# Altium schematic sheet Control_Sense_TOP_VAC.SchDoc (part 2 of 4)
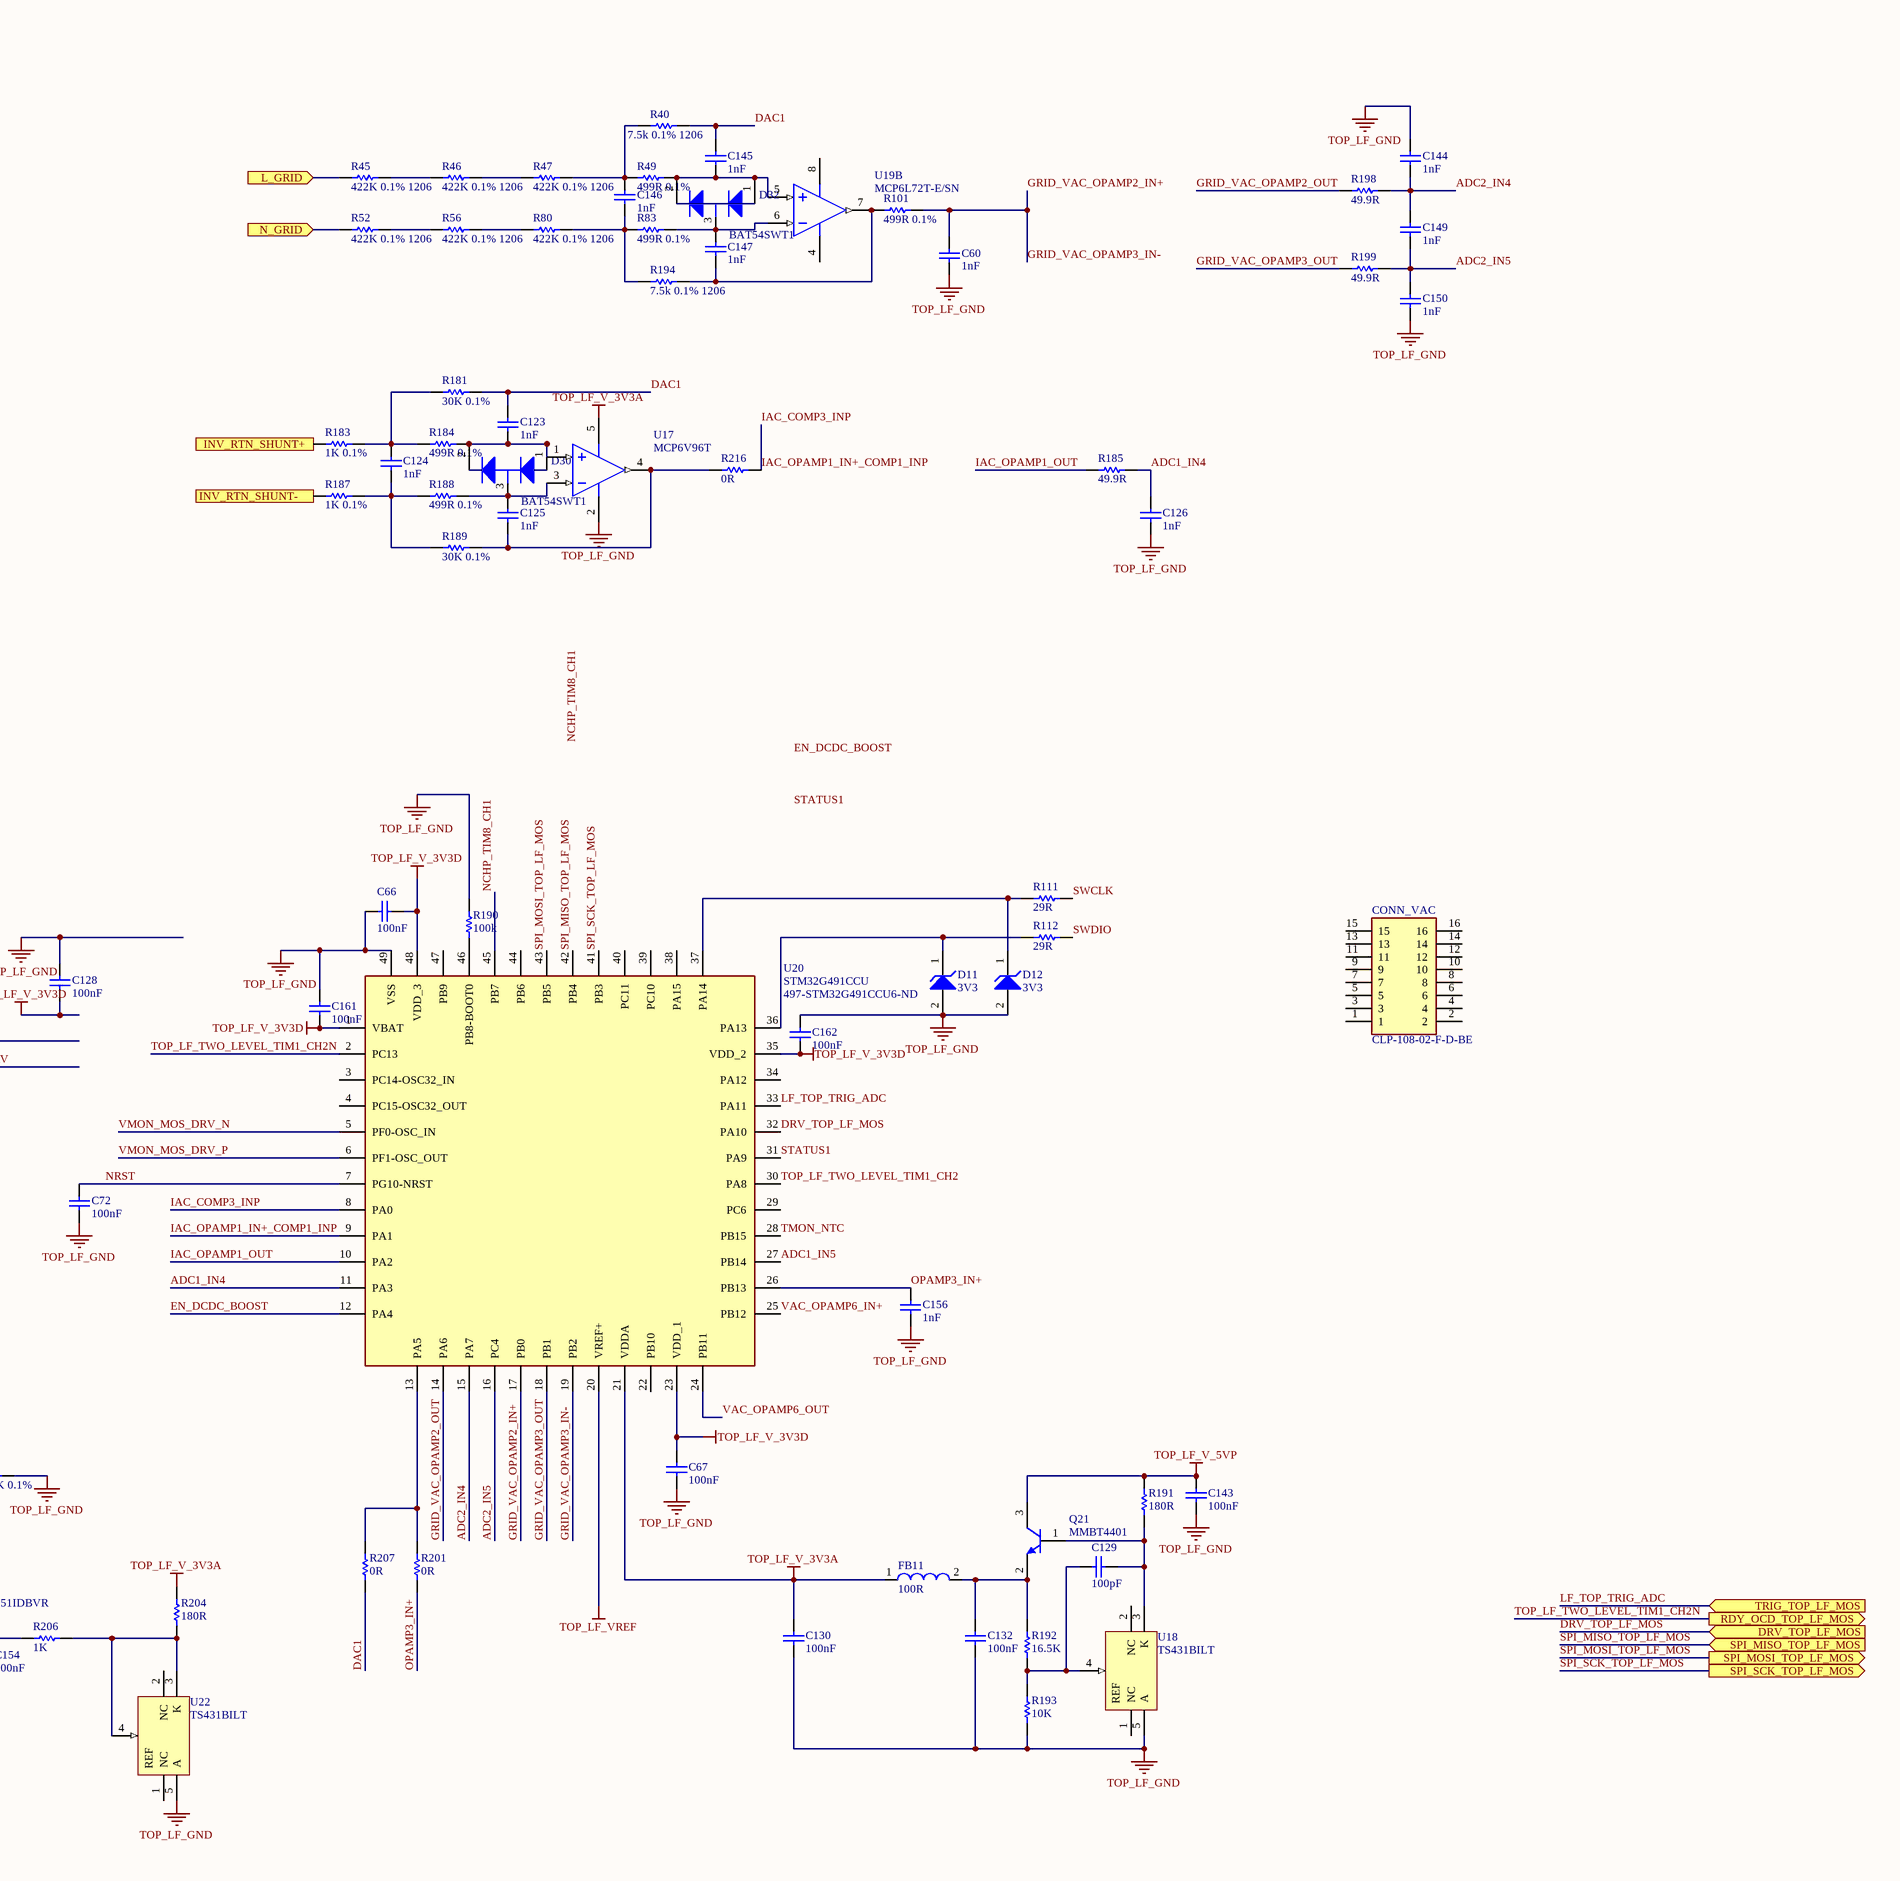
[diagram p4: Control_Sense_TOP_VAC.SchDoc, bottom right]
## Library data of the parts
C30 C41 C66 C67 C106 C108 C109 C128 C130 C132 C143 C152 C154 C155 C161 C162 = CMP-2000-05332-1: Cap Ceramic 0.1uF 50VDC X7R 10% SMD 0603 Paper T/R; Manufacturer: Samsung Electro-Mechanics; Manufacturer Part Number: CL10B104KB8NNNC; Capacitance: 0.1µF; Rated Voltage: 50V; Case Size/Dimension: 0603; Datasheet URL: https://datasheet.ciiva.com/29198/456651-da-01-en-vs-kondensator-0605-29198839.pdf; Manufacturer URL: http://www.samsungsem.com/global/index.jsp; Dielectric: X7R; Tolerance (%): ±10%; Datasheet Version: Nov-10; Supplier 1: Digi-Key; Supplier Part Number 1: 1276-1000-1-ND; RoHS: Yes; Category: Ceramic Capacitors; Stock 1: 13409690; Pricing 1: 1=0.10000, 10=0.03000, 50=0.01620, 100=0.01330, 500=0.00950, 1000=0.00746 (USD); Mount: Surface Mount; Case/Package: 0603; Case Code (Metric): 1608; Case Code (Imperial): 0603; Contact Plating: Tin; Material: Ceramic; Min Operating Temperature: -55°C; Max Operating Temperature: 125°C; Voltage Rating: 50V; Package Quantity: 1; Packaging: Tape and Reel; Tolerance: 10%; Voltage Rating (DC): 50V; Voltage: 50V; Series: CL; Construction: Flat; Length: 1.6mm; Width: 0.031inch; Height: 0.8mm; Depth: 0.8mm; Thickness: 0.035inch; Radiation Hardening: No; Lead Free: Lead Free; RoHS Compliant: Yes; ComponentLink1URL: https://datasheet.ciiva.com/25803/cl10b104kb8nnnc-25803393.pdf?src-supplier=Digi-Key; ComponentLink1Description: https://datasheet.ciiva.com/25803/cl10b104kb8nnnc-25803393.pdf?src-supplier=Digi-Key; ComponentLink2URL: https://datasheet.ciiva.com/26838/getdatasheetpartid-89097-26838411.pdf?src-supplier=Verical; ComponentLink2Description: https://datasheet.ciiva.com/26838/getdatasheetpartid-89097-26838411.pdf?src-supplier=Verical; ComponentLink3URL: https://datasheet.ciiva.com/29198/456651-da-01-en-vs-kondensator-0605-29198839.pdf?src-supplier=Conrad; ComponentLink3Description: https://datasheet.ciiva.com/29198/456651-da-01-en-vs-kondensator-0605-29198839.pdf?src-supplier=Conrad
C50-C52 C60 C93-C95 C99 C103-C105 C123-C125 C141 C145-C147 C158 = CMP-2006-04245-1: Manufacturer: AVX Interconnect / Elco; Part Number: 06035A151JAT2A.; Manufacturer Part Number: 06035A151JAT2A; Dielectric Material: Ceramic; Capacitance: 100pF; Tolerance: 5%; Voltage Rating (DC): 50V; Dielectric: C0G; Temperature Coefficient: 30ppm/°C; Insulation Resistance: 100GR; Supplier 1: Digi-Key; Supplier Part Number 1: 478-1177-1-ND; RoHS: Yes; Category: Ceramic Capacitors; Stock 1: 63714; Pricing 1: 1=0.12000, 10=0.08900, 100=0.04180, 500=0.02932, 1000=0.02428 (USD); Mount: Surface Mount,PCB; Case/Package: 0603; Number of Pins: 2; Case Code (Metric): 1608; Case Code (Imperial): 0603; Contact Plating: Tin,Matte; Min Operating Temperature: -55°C; Max Operating Temperature: 125°C; Voltage Rating: 50V; Packaging: Tape and Reel; Package Quantity: 1; Termination: SMD/SMT; Voltage: 50V; Length: 1.6mm; Height: 0.86mm; Width: 0.032inch; Depth: 0.81mm; Thickness: 0.035inch; Radiation Hardening: No; Lead Free: Lead Free; REACH SVHC: No SVHC; ComponentLink1URL: https://datasheet.ciiva.com/1124/84496-1124721.pdf?src-supplier=Element14; ComponentLink1Description: https://datasheet.ciiva.com/1124/84496-1124721.pdf?src-supplier=Element14; ComponentLink2URL: https://datasheet.ciiva.com/2987/ccog-2987781.pdf?src-supplier=Avnet; ComponentLink2Description: https://datasheet.ciiva.com/2987/ccog-2987781.pdf?src-supplier=Avnet; ComponentLink3URL: https://datasheet.ciiva.com/7855/759117-7855061.pdf?src-supplier=Element14; ComponentLink3Description: https://datasheet.ciiva.com/7855/759117-7855061.pdf?src-supplier=Element14; ComponentLink4URL: https://datasheet.ciiva.com/2987/ccog-2987782.pdf?src-supplier=Avnet; ComponentLink4Description: https://datasheet.ciiva.com/2987/ccog-2987782.pdf?src-supplier=Avnet; ComponentLink5URL: https://datasheet.ciiva.com/156/ccog-156216.pdf?src-supplier=Digi-Key; ComponentLink5Description: https://datasheet.ciiva.com/156/ccog-156216.pdf?src-supplier=Digi-Key; ComponentLink6URL: https://datasheet.ciiva.com/156/ccog-156217.pdf?src-supplier=Digi-Key; ComponentLink6Description: https://datasheet.ciiva.com/156/ccog-156217.pdf?src-supplier=Digi-Key; ComponentLink7URL: https://datasheet.ciiva.com/156/ccog-156218.pdf?src-supplier=Digi-Key; ComponentLink7Description: https://datasheet.ciiva.com/156/ccog-156218.pdf?src-supplier=Digi-Key; ComponentLink8URL: https://datasheet.ciiva.com/16300/ccog-16300429.pdf?src-supplier=Future+Electronics; ComponentLink8Description: https://datasheet.ciiva.com/16300/ccog-16300429.pdf?src-supplier=Future+Electronics; ComponentLink9URL: https://datasheet.ciiva.com/22699/84496-22699966.pdf?src-supplier=Element14; ComponentLink9Description: https://datasheet.ciiva.com/22699/84496-22699966.pdf?src-supplier=Element14; ComponentLink10URL: https://datasheet.ciiva.com/5418/ccog-5418335.pdf?src-supplier=Mouser; ComponentLink10Description: https://datasheet.ciiva.com/5418/ccog-5418335.pdf?src-supplier=Mouser; ComponentLink11URL: https://datasheet.ciiva.com/16538/ccog-16538111.pdf?src-supplier=Avnet+Asia; ComponentLink11Description: https://datasheet.ciiva.com/16538/ccog-16538111.pdf?src-supplier=Avnet+Asia
C65 C72 C163 = CMP-2008-02743-1: Manufacturer: AVX Interconnect / Elco; Part Number: 04026D104KAT2A; Dielectric Material: Ceramic; Tolerance: 10%; Voltage Rating: 6.3V; Dielectric: X5R; Supplier 1: Newark; Supplier Part Number 1: 34M9214; Manufacturer Part Number: 04026D104KAT2A; RoHS: Yes; Category: Ceramic Capacitors; Stock 1: 1436; Pricing 1: 10=0.02800, 25=0.02300, 50=0.01800, 100=0.01200, 250=0.01100, 500=0.00900, 1000=0.00700 (USD); Mount: Surface Mount; Case/Package: 0402; Case Code (Metric): 1005; Case Code (Imperial): 0402; Contact Plating: Tin,Matte; Min Operating Temperature: -55°C; Max Operating Temperature: 85°C; Package Quantity: 1; Packaging: Tape and Reel; Capacitance: 100nF; Voltage Rating (DC): 6.3V; Voltage: 6.3V; Termination: SMD/SMT; Series: -; Construction: Flat; Length: 1mm; Width: 0.02inch; Height: 0.56mm; Thickness: 0.022inch; Depth: 0.5mm; Radiation Hardening: No; REACH SVHC: No SVHC; Lead Free: Lead Free; RoHS Compliant: Yes
C96 C160 = CMP-2007-03234-1: SMD Multilayer Ceramic Capacitor, 1 µF, 25 V, 0805 [2012 Metric], ± 10%, X7R; Part Number: C0805C105K3RACTU; Manufacturer: Kemet; Voltage Rating: 25V; Supplier 1: Digi-Key; Supplier Part Number 1: 399-8004-1-ND; Manufacturer Part Number: C0805C105K3RACTU; RoHS: Yes; Category: Ceramic Capacitors; Stock 1: 73815; Pricing 1: 1=0.14000, 10=0.09900, 50=0.05620, 100=0.04650, 500=0.03262, 1000=0.02700 (USD); Mount: Surface Mount; Case/Package: 0805; Number of Pins: 2; Case Code (Imperial): 0805; Case Code (Metric): 2012; Dielectric Material: Ceramic; Contact Plating: Tin,Matte; Min Operating Temperature: -55°C; Max Operating Temperature: 125°C; Capacitance: 1uF; Tolerance: 10%; Packaging: Tape and Reel; Dielectric: X7R; Package Quantity: 1; Voltage Rating (DC): 25V; Termination: SMD/SMT; Series: C; Construction: Flat; Voltage: 25V; Length: 2mm; Width: 0.049inch; Height: 1.25mm; Depth: 1.25mm; Thickness: 0.055inch; Radiation Hardening: No; RoHS Compliant: Yes; REACH SVHC: No SVHC; ComponentLink1URL: https://datasheet.ciiva.com/6074/kem-c1002-x7r-smd-6074661.pdf?src-supplier=Farnell; ComponentLink1Description: https://datasheet.ciiva.com/6074/kem-c1002-x7r-smd-6074661.pdf?src-supplier=Farnell; ComponentLink2URL: https://datasheet.ciiva.com/28610/1918693-28610874.pdf?src-supplier=Element14; ComponentLink2Description: https://datasheet.ciiva.com/28610/1918693-28610874.pdf?src-supplier=Element14; ComponentLink3URL: https://datasheet.ciiva.com/46443/1851736-46443533.pdf?src-supplier=Element14; ComponentLink3Description: https://datasheet.ciiva.com/46443/1851736-46443533.pdf?src-supplier=Element14
C97 = CMP-2000-06039-1: Chip Capacitor, 4.7 uF, +/- 10%, 25 V, -55 to 125 degC, 0805 (2012 Metric), RoHS, Tape and Reel; Manufacturer: TDK; PCN Part Number: MLCCPartNumberChange30/Nov/2012; Other Names: 445-5972-2C2012X7R1E475KC2012X7R1E475KT000N; Temperature Coefficient: X7R; Voltage - Rated: 25V; Product Training Modules: CSeriesGeneralApplicationsSEAT,CCV,andTVCLDesignToolsGuidetoReplacinganElectrolyticCapacitorwithanMLCC; Catalog Drawings: CSERIES_2012-0805_1.45; Online Catalog: CSeries,GeneralPurpose; Capacitance: 4.7µF; Package Description: 2-Pin Surface Mount Device, Body 2 x 1.25 mm; Manufacturer URL: http://www.tdk.com/; Features: -; Family: CeramicCapacitors; Applications: GeneralPurpose; Standard Package: 2,000; RoHS Information: RoHSCertificate-MLCC; Operating Temperature: -55°C~125°C; Lead Spacing: -; Lead Style: -; Datasheet Version: 01/2016; Datasheet URL: https://product.tdk.com/info/en/documents/chara_sheet/C2012X7R1E475K125AB.pdf; Series: C; Package Reference: 0805; Category: Capacitors; Ratings: -; Packaging: Tape&Reel(TR); Tolerance: ±10%; Height - Seated (Max): -; Size / Dimension: 0.079"Lx0.049"W(2.00mmx1.25mm); Package / Case: 0805(2012Metric); Mounting Technology: SurfaceMount; Mounting Type: SurfaceMount,MLCC; Thickness (Max): 0.057"(1.45mm)
C102 = CMP-2000-05863-1: Chip Capacitor, 10 uF, +/- 10%, 25 V, -55 to 85 degC, 1206 (3216 Metric), RoHS, Tape and Reel; Manufacturer: AVX; Dielectric: X5R; Capacitance: 10µF; Mounting Technology: SurfaceMount; Package Reference: 1206; Tolerance (%): ±10%; Manufacturer URL: http://www.avx.com/; Rated Voltage: 25V; Datasheet URL: http://datasheets.avx.com/cx5r.pdf; Package Description: 2-Pin Surface Mount Device, Body 3.2 x 1.6 mm; Datasheet Version: 05/2016; Case Size/Dimension: 1206
C107 C129 = CMP-2006-02595-1: 0603 100pF 50V ±5 % Tolerance C0G SMT Multilayer Ceramic Capacitor; Part Number: GRM1885C1H101JA01D; Manufacturer: Murata; Tolerance: 5%; Temperature Coefficient: 30ppm/°C; Insulation Resistance: 10GR; Supplier 1: Digi-Key; Supplier Part Number 1: 490-1427-1-ND; Manufacturer Part Number: GRM1885C1H101JA01D; RoHS: Yes; Category: Ceramic Capacitors; Stock 1: 416176; Pricing 1: 1=0.10000, 10=0.06100, 50=0.03320, 100=0.02700, 500=0.01932, 1000=0.01518 (USD); Mount: Surface Mount; Case/Package: 0603; Number of Pins: 2; Case Code (Metric): 1608; Case Code (Imperial): 0603; Dielectric Material: Ceramic; Material: Ceramic; Weight: 7.1E-05oz; Min Operating Temperature: -55°C; Max Operating Temperature: 125°C; Capacitance: 100pF; Voltage Rating: 50V; Packaging: Tape and Reel; Package Quantity: 1; Voltage Rating (DC): 50V; Dielectric: C0G; Termination: SMD/SMT; Voltage: 50V; Length: 1.6mm; Width: 0.031inch; Height: 0.8mm; Thickness: 0.035inch; Depth: 0.8mm; Radiation Hardening: No; REACH SVHC: Unknown; RoHS Compliant: Yes; Lead Free: Lead Free; ComponentLink1URL: https://datasheet.ciiva.com/131/product-131088.pdf?src-supplier=Digi-Key; ComponentLink1Description: https://datasheet.ciiva.com/131/product-131088.pdf?src-supplier=Digi-Key; ComponentLink2URL: https://datasheet.ciiva.com/18100/getdatasheetpartid-26823-18100641.pdf?src-supplier=Verical; ComponentLink2Description: https://datasheet.ciiva.com/18100/getdatasheetpartid-26823-18100641.pdf?src-supplier=Verical; ComponentLink3URL: https://datasheet.ciiva.com/3777/grm1885c1h101ja0123-3777264.pdf?src-supplier=Arrow+Electronics; ComponentLink3Description: https://datasheet.ciiva.com/3777/grm1885c1h101ja0123-3777264.pdf?src-supplier=Arrow+Electronics; ComponentLink4URL: https://datasheet.ciiva.com/29149/450134-da-01-en-vs-kondensator-0603-29149008.pdf?src-supplier=Conrad; ComponentLink4Description: https://datasheet.ciiva.com/29149/450134-da-01-en-vs-kondensator-0603-29149008.pdf?src-supplier=Conrad; ComponentLink5URL: https://datasheet.ciiva.com/131/partnumbering-e-01-131089.pdf?src-supplier=Digi-Key; ComponentLink5Description: https://datasheet.ciiva.com/131/partnumbering-e-01-131089.pdf?src-supplier=Digi-Key; ComponentLink6URL: https://datasheet.ciiva.com/11605/c02e-11605557.pdf?src-supplier=Avnet; ComponentLink6Description: https://datasheet.ciiva.com/11605/c02e-11605557.pdf?src-supplier=Avnet; ComponentLink7URL: https://datasheet.ciiva.com/28556/4360-28556551.pdf?src-supplier=Element14; ComponentLink7Description: https://datasheet.ciiva.com/28556/4360-28556551.pdf?src-supplier=Element14; ComponentLink8URL: https://datasheet.ciiva.com/7828/4360-7828889.pdf?src-supplier=Element14; ComponentLink8Description: https://datasheet.ciiva.com/7828/4360-7828889.pdf?src-supplier=Element14; ComponentLink9URL: https://datasheet.ciiva.com/7828/4360-7828890.pdf?src-supplier=Element14; ComponentLink9Description: https://datasheet.ciiva.com/7828/4360-7828890.pdf?src-supplier=Element14; ComponentLink10URL: https://datasheet.ciiva.com/7828/4360-7828891.pdf?src-supplier=Element14; ComponentLink10Description: https://datasheet.ciiva.com/7828/4360-7828891.pdf?src-supplier=Element14; ComponentLink11URL: https://datasheet.ciiva.com/14116/grmseries-tc-hitype-eng-14116828.pdf?src-supplier=Distrelec; ComponentLink11Description: https://datasheet.ciiva.com/14116/grmseries-tc-hitype-eng-14116828.pdf?src-supplier=Distrelec; ComponentLink12URL: https://datasheet.ciiva.com/16291/product-16291613.pdf?src-supplier=Future+Electronics; ComponentLink12Description: https://datasheet.ciiva.com/16291/product-16291613.pdf?src-supplier=Future+Electronics; ComponentLink13URL: https://datasheet.ciiva.com/131/partnumbering-e-01-131087.pdf?src-supplier=Digi-Key; ComponentLink13Description: https://datasheet.ciiva.com/131/partnumbering-e-01-131087.pdf?src-supplier=Digi-Key; ComponentLink14URL: https://datasheet.ciiva.com/14116/grmseries-tc-hitype-eng-14116815.pdf?src-supplier=Distrelec; ComponentLink14Description: https://datasheet.ciiva.com/14116/grmseries-tc-hitype-eng-14116815.pdf?src-supplier=Distrelec
C110 = CMP-2006-04481-1: Cap Ceramic 4.7uF 6.3VDC X5R 10% SMD 0603 Paper T/R; Part Number: 06036D475KAT2A; Manufacturer: AVX Interconnect / Elco; Tolerance: 20%; Voltage Rating (DC): 6.3V; Supplier 1: Mouser; Supplier Part Number 1: 581-06036D475K; Manufacturer Part Number: 06036D475KAT2A; RoHS: Yes; Category: Ceramic Capacitors; Stock 1: 80199; Pricing 1: 1=0.19000, 10=0.11100, 50=0.11100, 100=0.06000, 1000=0.04900, 10000=0.04800 (USD); Mount: Surface Mount,PCB; Case/Package: 0603; Number of Pins: 2; Case Code (Metric): 1608; Case Code (Imperial): 0603; Contact Plating: Tin,Matte; Dielectric Material: Ceramic; Min Operating Temperature: -55°C; Max Operating Temperature: 85°C; Capacitance: 4.7uF; Packaging: Tape and Reel; Voltage Rating: 6.3V; Package Quantity: 1; Dielectric: X5R; Voltage: 6.3V; Termination: SMD/SMT; Series: -; Construction: Flat; Length: 1.6mm; Width: 0.032inch; Height: 0.9mm; Thickness: 0.035inch; Depth: 0.81mm; Radiation Hardening: No; REACH SVHC: No SVHC; Lead Free: Lead Free; RoHS Compliant: Yes; ComponentLink1URL: https://datasheet.ciiva.com/1458/1796776-1458120.pdf?src-supplier=Element14; ComponentLink1Description: https://datasheet.ciiva.com/1458/1796776-1458120.pdf?src-supplier=Element14; ComponentLink2URL: https://datasheet.ciiva.com/15212/getdatasheetpartid-149720-15212362.pdf?src-supplier=Verical; ComponentLink2Description: https://datasheet.ciiva.com/15212/getdatasheetpartid-149720-15212362.pdf?src-supplier=Verical; ComponentLink3URL: https://datasheet.ciiva.com/151/cx5r-151515.pdf?src-supplier=Digi-Key; ComponentLink3Description: https://datasheet.ciiva.com/151/cx5r-151515.pdf?src-supplier=Digi-Key; ComponentLink4URL: https://datasheet.ciiva.com/151/cx5r-151516.pdf?src-supplier=Digi-Key; ComponentLink4Description: https://datasheet.ciiva.com/151/cx5r-151516.pdf?src-supplier=Digi-Key; ComponentLink5URL: https://datasheet.ciiva.com/22677/lt-22677180.pdf?src-supplier=Element14; ComponentLink5Description: https://datasheet.ciiva.com/22677/lt-22677180.pdf?src-supplier=Element14; ComponentLink6URL: https://datasheet.ciiva.com/22700/1796776-22700572.pdf?src-supplier=Element14; ComponentLink6Description: https://datasheet.ciiva.com/22700/1796776-22700572.pdf?src-supplier=Element14; ComponentLink7URL: https://datasheet.ciiva.com/151/cx5r-151517.pdf?src-supplier=Digi-Key; ComponentLink7Description: https://datasheet.ciiva.com/151/cx5r-151517.pdf?src-supplier=Digi-Key; ComponentLink8URL: https://datasheet.ciiva.com/2987/cx5r-2987869.pdf?src-supplier=Avnet; ComponentLink8Description: https://datasheet.ciiva.com/2987/cx5r-2987869.pdf?src-supplier=Avnet; ComponentLink9URL: https://datasheet.ciiva.com/6150/lt-6150797.pdf?src-supplier=Farnell; ComponentLink9Description: https://datasheet.ciiva.com/6150/lt-6150797.pdf?src-supplier=Farnell; ComponentLink10URL: https://datasheet.ciiva.com/7855/1666675-7855102.pdf?src-supplier=Element14; ComponentLink10Description: https://datasheet.ciiva.com/7855/1666675-7855102.pdf?src-supplier=Element14
C111 = CMP-2000-05332-1: Cap Ceramic 4.7uF 6.3VDC X5R 10% SMD 0603 Paper T/R; Manufacturer: Samsung Electro-Mechanics; Manufacturer Part Number: CL10B104KB8NNNC; Capacitance: 0.1µF; Rated Voltage: 50V; Dielectric: X7R; Case Size/Dimension: 0603; Datasheet URL: https://datasheet.ciiva.com/29198/456651-da-01-en-vs-kondensator-0605-29198839.pdf; Manufacturer URL: http://www.samsungsem.com/global/index.jsp; Tolerance (%): ±10%; Datasheet Version: Nov-10; Supplier 1: Digi-Key; Supplier Part Number 1: 1276-1000-1-ND; RoHS: Yes; Category: Ceramic Capacitors; Stock 1: 13409690; Pricing 1: 1=0.10000, 10=0.03000, 50=0.01620, 100=0.01330, 500=0.00950, 1000=0.00746 (USD); Mount: Surface Mount; Case/Package: 0603; Case Code (Metric): 1608; Case Code (Imperial): 0603; Contact Plating: Tin; Material: Ceramic; Min Operating Temperature: -55°C; Max Operating Temperature: 125°C; Voltage Rating: 50V; Package Quantity: 1; Packaging: Tape and Reel; Tolerance: 10%; Voltage Rating (DC): 50V; Voltage: 50V; Series: CL; Construction: Flat; Length: 1.6mm; Width: 0.031inch; Height: 0.8mm; Depth: 0.8mm; Thickness: 0.035inch; Radiation Hardening: No; Lead Free: Lead Free; RoHS Compliant: Yes; ComponentLink1URL: https://datasheet.ciiva.com/25803/cl10b104kb8nnnc-25803393.pdf?src-supplier=Digi-Key; ComponentLink1Description: https://datasheet.ciiva.com/25803/cl10b104kb8nnnc-25803393.pdf?src-supplier=Digi-Key; ComponentLink2URL: https://datasheet.ciiva.com/26838/getdatasheetpartid-89097-26838411.pdf?src-supplier=Verical; ComponentLink2Description: https://datasheet.ciiva.com/26838/getdatasheetpartid-89097-26838411.pdf?src-supplier=Verical; ComponentLink3URL: https://datasheet.ciiva.com/29198/456651-da-01-en-vs-kondensator-0605-29198839.pdf?src-supplier=Conrad; ComponentLink3Description: https://datasheet.ciiva.com/29198/456651-da-01-en-vs-kondensator-0605-29198839.pdf?src-supplier=Conrad
C112 = CMP-2100-03644-1: Chip Capacitor, 0.1 uF, +/- 10%, 50 V, -55 to 125 degC, 0805 (2012 Metric), RoHS, Tape and Reel; Manufacturer: Murata; Manufacturer Part Number: GRM21BR71H104KA01L; Voltage: 50V; Capacitance: 100nF; Insulation Resistance: 10GR; Dielectric Material: Ceramic; Dielectric: X7R; Package Description: 2-Pin Surface Mount Device, Body 2 x 1.25 mm; Manufacturer URL: http://www.murata.com/; Case Code (Imperial): 0805; Datasheet URL: http://psearch.en.murata.com/capacitor/product/GRM21BR71H104KA01%23.pdf; Termination: SMD/SMT; Lead Free: LeadFree; Package Quantity: 1; Mount: SurfaceMount; REACH SVHC: Unknown; Thickness: 0.053inch; Height: 1.25mm; Case/Package: 0805; Voltage Rating: 50V; Width: 0.049inch; Case Code (Metric): 2012; Material: Ceramic; Min Operating Temperature: -55degC; RoHSCompliant: true; Datasheet Version: 42675.0; Voltage Rating (DC): 50V; Tolerance: 10%; Package Reference: 0805; Depth: 1.25mm; Length: 2mm; Max Operating Temperature: 125degC; Packaging: TapeandReel; Number of Pins: 2; Radiation Hardening: No; Supplier 1: Farnell; Supplier Part Number 1: 2408531; RoHS: Yes; Category: Ceramic Capacitors; Stock 1: 576000; ComponentLink1URL: https://datasheet.ciiva.com/11786/0900766b8003061f-11786305.pdf?src-supplier=RSComponents; ComponentLink1Description: https://datasheet.ciiva.com/11786/0900766b8003061f-11786305.pdf?src-supplier=RSComponents; ComponentLink2URL: https://datasheet.ciiva.com/20173/71-2024-20173169.pdf?src-supplier=Rapid+Electronics; ComponentLink2Description: https://datasheet.ciiva.com/20173/71-2024-20173169.pdf?src-supplier=Rapid+Electronics; ComponentLink3URL: https://datasheet.ciiva.com/29200/453120-da-01-en-vs-kondensator-0805-29200537.pdf?src-supplier=Conrad; ComponentLink3Description: https://datasheet.ciiva.com/29200/453120-da-01-en-vs-kondensator-0805-29200537.pdf?src-supplier=Conrad; ComponentLink4URL: https://datasheet.ciiva.com/132/partnumbering-e-01-132209.pdf?src-supplier=Digi-Key; ComponentLink4Description: https://datasheet.ciiva.com/132/partnumbering-e-01-132209.pdf?src-supplier=Digi-Key; ComponentLink5URL: https://datasheet.ciiva.com/132/partnumbering-e-01-132210.pdf?src-supplier=Digi-Key; ComponentLink5Description: https://datasheet.ciiva.com/132/partnumbering-e-01-132210.pdf?src-supplier=Digi-Key; ComponentLink6URL: https://datasheet.ciiva.com/132/partnumbering-e-01-132211.pdf?src-supplier=Digi-Key; ComponentLink6Description: https://datasheet.ciiva.com/132/partnumbering-e-01-132211.pdf?src-supplier=Digi-Key; ComponentLink7URL: https://datasheet.ciiva.com/7937/1794405-7937708.pdf?src-supplier=Element14; ComponentLink7Description: https://datasheet.ciiva.com/7937/1794405-7937708.pdf?src-supplier=Element14; ComponentLink8URL: https://datasheet.ciiva.com/7937/1794405-7937709.pdf?src-supplier=Element14; ComponentLink8Description: https://datasheet.ciiva.com/7937/1794405-7937709.pdf?src-supplier=Element14; ComponentLink9URL: https://datasheet.ciiva.com/28534/1769893-28534317.pdf?src-supplier=Element14; ComponentLink9Description: https://datasheet.ciiva.com/28534/1769893-28534317.pdf?src-supplier=Element14; ComponentLink10URL: https://datasheet.ciiva.com/7937/4360-7937710.pdf?src-supplier=Element14; ComponentLink10Description: https://datasheet.ciiva.com/7937/4360-7937710.pdf?src-supplier=Element14
C113 = CAPC_1u_0805_X7R_16V_10%: Capacitor SMD Cer 1uF 10% 16V X7R 0805; Manufacturer 1: Yageo; Manufacturer Part Number 1: CC0805KKX7R7BB105; Ratings: 16V; X7R; Material: ceramic; SCDType: spec; Package / Case: 0805 (2012 metric); Tolerance: ±10%; Supplier 1: Digi-Key; Supplier Part Number 1: 311-1365-6-ND; RoHS 1: RoHS Compliant; Temperature Coefficient: X7R; ComponentLink1URL: http://www.yageo.com/documents/recent/UPY-GPHC_X7R_6.3V-to-50V_8.pdf; ComponentLink1Description: http://www.yageo.com/documents/recent/UPY-GPHC_X7R_6.3V-to-50V_8.pdf; Supplier 2: Digi-Key; Supplier Part Number 2: 399-1284-6-ND; Manufacturer 2: Kemet; Manufacturer Part Number 2: C0805C105K4RACTU; RoHS 2: RoHS Compliant; ComponentLink2URL: http://www.kemet.com/datasheets&C0805C105K4RACTU; ComponentLink2Description: http://www.kemet.com/datasheets&C0805C105K4RACTU; Supplier 3: Digi-Key; Supplier Part Number 3: 1276-1026-6-ND; Manufacturer 3: Samsung Electro-Mechanics America, Inc; Manufacturer Part Number 3: CL21B105KOFNNNE; RoHS 3: RoHS Compliant; ComponentLink3URL: http://www.samsungsem.com/servlet/FileDownload?type=spec&file=CL21B105KOFNNNE.pdf; ComponentLink3Description: http://www.samsungsem.com/servlet/FileDownload?type=spec&file=CL21B105KOFNNNE.pdf; Supplier 4: Digi-Key; Supplier Part Number 4: 445-1358-6-ND; Manufacturer 4: TDK Corporation; Manufacturer Part Number 4: C2012X7R1C105K125AA; RoHS 4: RoHS Compliant; ComponentLink4URL: http://product.tdk.com/capacitor/mlcc/en/documents/mlcc_commercial_general_en.pdf; ComponentLink4Description: http://product.tdk.com/capacitor/mlcc/en/documents/mlcc_commercial_general_en.pdf
C121 C122 = CMP-2006-02595-1: Part Number: GRM1885C1H101JA01D; Manufacturer: Murata; Dielectric Material: Ceramic; Voltage Rating: 50V; Tolerance: 5%; Dielectric: C0G; Temperature Coefficient: 30ppm/°C; Insulation Resistance: 10GR; Supplier 1: Digi-Key; Supplier Part Number 1: 490-1427-1-ND; Manufacturer Part Number: GRM1885C1H101JA01D; RoHS: Yes; Category: Ceramic Capacitors; Stock 1: 98306; Pricing 1: 1=0.10000, 10=0.06100, 50=0.03320, 100=0.02700, 500=0.01932, 1000=0.01518 (USD); Mount: Surface Mount; Case/Package: 0603; Number of Pins: 2; Case Code (Metric): 1608; Case Code (Imperial): 0603; Weight: 7.1E-05oz; Material: Ceramic; Min Operating Temperature: -55°C; Max Operating Temperature: 125°C; Capacitance: 100pF; Packaging: Tape and Reel; Package Quantity: 1; Voltage Rating (DC): 50V; Termination: SMD/SMT; Voltage: 50V; Length: 1.6mm; Width: 0.031inch; Height: 0.8mm; Thickness: 0.035inch; Depth: 0.8mm; Radiation Hardening: No; RoHS Compliant: Yes; REACH SVHC: Unknown; Lead Free: Lead Free; ComponentLink1URL: https://datasheet.ciiva.com/131/product-131088.pdf?src-supplier=Digi-Key; ComponentLink1Description: https://datasheet.ciiva.com/131/product-131088.pdf?src-supplier=Digi-Key; ComponentLink2URL: https://datasheet.ciiva.com/18100/getdatasheetpartid-26823-18100641.pdf?src-supplier=Verical; ComponentLink2Description: https://datasheet.ciiva.com/18100/getdatasheetpartid-26823-18100641.pdf?src-supplier=Verical; ComponentLink3URL: https://datasheet.ciiva.com/3777/grm1885c1h101ja0123-3777264.pdf?src-supplier=Arrow+Electronics; ComponentLink3Description: https://datasheet.ciiva.com/3777/grm1885c1h101ja0123-3777264.pdf?src-supplier=Arrow+Electronics; ComponentLink4URL: https://datasheet.ciiva.com/29149/450134-da-01-en-vs-kondensator-0603-29149008.pdf?src-supplier=Conrad; ComponentLink4Description: https://datasheet.ciiva.com/29149/450134-da-01-en-vs-kondensator-0603-29149008.pdf?src-supplier=Conrad; ComponentLink5URL: https://datasheet.ciiva.com/131/partnumbering-e-01-131089.pdf?src-supplier=Digi-Key; ComponentLink5Description: https://datasheet.ciiva.com/131/partnumbering-e-01-131089.pdf?src-supplier=Digi-Key; ComponentLink6URL: https://datasheet.ciiva.com/11605/c02e-11605557.pdf?src-supplier=Avnet; ComponentLink6Description: https://datasheet.ciiva.com/11605/c02e-11605557.pdf?src-supplier=Avnet; ComponentLink7URL: https://datasheet.ciiva.com/28556/4360-28556551.pdf?src-supplier=Element14; ComponentLink7Description: https://datasheet.ciiva.com/28556/4360-28556551.pdf?src-supplier=Element14; ComponentLink8URL: https://datasheet.ciiva.com/7828/4360-7828889.pdf?src-supplier=Element14; ComponentLink8Description: https://datasheet.ciiva.com/7828/4360-7828889.pdf?src-supplier=Element14; ComponentLink9URL: https://datasheet.ciiva.com/7828/4360-7828890.pdf?src-supplier=Element14; ComponentLink9Description: https://datasheet.ciiva.com/7828/4360-7828890.pdf?src-supplier=Element14; ComponentLink10URL: https://datasheet.ciiva.com/7828/4360-7828891.pdf?src-supplier=Element14; ComponentLink10Description: https://datasheet.ciiva.com/7828/4360-7828891.pdf?src-supplier=Element14; ComponentLink11URL: https://datasheet.ciiva.com/14116/grmseries-tc-hitype-eng-14116828.pdf?src-supplier=Distrelec; ComponentLink11Description: https://datasheet.ciiva.com/14116/grmseries-tc-hitype-eng-14116828.pdf?src-supplier=Distrelec; ComponentLink12URL: https://datasheet.ciiva.com/16291/product-16291613.pdf?src-supplier=Future+Electronics; ComponentLink12Description: https://datasheet.ciiva.com/16291/product-16291613.pdf?src-supplier=Future+Electronics; ComponentLink13URL: https://datasheet.ciiva.com/131/partnumbering-e-01-131087.pdf?src-supplier=Digi-Key; ComponentLink13Description: https://datasheet.ciiva.com/131/partnumbering-e-01-131087.pdf?src-supplier=Digi-Key; ComponentLink14URL: https://datasheet.ciiva.com/14116/grmseries-tc-hitype-eng-14116815.pdf?src-supplier=Distrelec; ComponentLink14Description: https://datasheet.ciiva.com/14116/grmseries-tc-hitype-eng-14116815.pdf?src-supplier=Distrelec
C126 C127 C144 C148-C151 C156 = CMP-2008-02701-1: Manufacturer: AVX Interconnect / Elco; Part Number: 04025C102MAT2A; Voltage Rating: 50V; Tolerance: 20%; Dielectric: X7R; Supplier 1: Digi-Key; Supplier Part Number 1: 478-5130-1-ND; Manufacturer Part Number: 04025C102MAT2A; RoHS: Yes; Category: Ceramic Capacitors; Stock 1: 32316; Pricing 1: 1=0.10000, 10=0.03300, 50=0.01800, 100=0.01470, 500=0.01046, 1000=0.00822, 2500=0.00748, 5000=0.00688 (USD); Mount: Surface Mount; Case/Package: 0402; Case Code (Metric): 1005; Case Code (Imperial): 0402; Min Operating Temperature: -55°C; Max Operating Temperature: 125°C; Capacitance: 1nF; Packaging: Tape and Reel; Package Quantity: 1; Voltage Rating (DC): 50V; Voltage: 50V; Series: -; Termination: SMD/SMT; Construction: Flat; Length: 1mm; Width: 0.02inch; Height: 0.56mm; Thickness: 0.022inch; Depth: 0.5mm; Radiation Hardening: No; RoHS Compliant: Yes; Lead Free: Lead Free; REACH SVHC: No SVHC; ComponentLink1URL: https://datasheet.ciiva.com/11787/0900766b80dc2409-11787048.pdf?src-supplier=RSComponents; ComponentLink1Description: https://datasheet.ciiva.com/11787/0900766b80dc2409-11787048.pdf?src-supplier=RSComponents; ComponentLink2URL: https://datasheet.ciiva.com/150/cx7r-150278.pdf?src-supplier=Digi-Key; ComponentLink2Description: https://datasheet.ciiva.com/150/cx7r-150278.pdf?src-supplier=Digi-Key; ComponentLink3URL: https://datasheet.ciiva.com/5424/cx7r-218113-5424822.pdf?src-supplier=Mouser; ComponentLink3Description: https://datasheet.ciiva.com/5424/cx7r-218113-5424822.pdf?src-supplier=Mouser; ComponentLink4URL: https://datasheet.ciiva.com/150/cx7r-150279.pdf?src-supplier=Digi-Key; ComponentLink4Description: https://datasheet.ciiva.com/150/cx7r-150279.pdf?src-supplier=Digi-Key; ComponentLink5URL: https://datasheet.ciiva.com/150/cx7r-150280.pdf?src-supplier=Digi-Key; ComponentLink5Description: https://datasheet.ciiva.com/150/cx7r-150280.pdf?src-supplier=Digi-Key; ComponentLink6URL: https://datasheet.ciiva.com/16327/cx7r-16327672.pdf?src-supplier=Future+Electronics; ComponentLink6Description: https://datasheet.ciiva.com/16327/cx7r-16327672.pdf?src-supplier=Future+Electronics; ComponentLink7URL: https://datasheet.ciiva.com/1123/1679506-1123707.pdf?src-supplier=Element14; ComponentLink7Description: https://datasheet.ciiva.com/1123/1679506-1123707.pdf?src-supplier=Element14; ComponentLink8URL: https://datasheet.ciiva.com/1123/1679506-1123708.pdf?src-supplier=Element14; ComponentLink8Description: https://datasheet.ciiva.com/1123/1679506-1123708.pdf?src-supplier=Element14; ComponentLink9URL: https://datasheet.ciiva.com/11510/cx7r-11510958.pdf?src-supplier=Avnet; ComponentLink9Description: https://datasheet.ciiva.com/11510/cx7r-11510958.pdf?src-supplier=Avnet; ComponentLink10URL: https://datasheet.ciiva.com/16623/cx7r-16623374.pdf?src-supplier=Avnet+Europe; ComponentLink10Description: https://datasheet.ciiva.com/16623/cx7r-16623374.pdf?src-supplier=Avnet+Europe
C153 = CMP-2006-04476-1: Manufacturer: AVX Interconnect / Elco; Part Number: 06036D106MAT2A
CONN_VAC = CLP-108-02-F-D-BE: Connector; Manufacturer_Name: SAMTEC; Datasheet Link: http://suddendocs.samtec.com/prints/erm8-xxx-xx.x-xxx-dv-xxxx-xx-mkt.pdf; Manufacturer_Part_Number: CLP-108-02-F-D-BE; Mouser Part Number: 200-CLP10802FDBE; Mouser Price/Stock: https://www.mouser.co.uk/ProductDetail/Samtec/CLP-108-02-F-D-BE?qs=0lQeLiL1qyYUOoO2ps5Gwg%3D%3D; Arrow Part Number: CLP-108-02-F-D-BE; Arrow Price/Stock: https://www.arrow.com/en/products/clp-108-02-f-d-be/samtec
D11 D12 = CMP-1063-00098-1: Transient Voltage Suppressor, Micro-Packaged Diode for ESD Protection, 2-Pin SOD-523, Pb-Free, Tape and Reel; Manufacturer: On Semiconductor; PartNumber: ESD5Z3.3T1G; VRWM Max (V): 3.3; Number of Lines: 1; V(BR) Min (V): 5; PPK Max (W): 158; Direction: Unidirectional; IR Max (uA): 0.05; PackageReference: SOD-523-2-502-01; PackageVersion: Rev. E, 09/2010; RoHS: Pb-Free; ComponentLink3Description: Package Specification; Packing: Tape and Reel; ComponentLink1URL: http://www.onsemi.com/; DatasheetVersion: Rev. 10; ComponentLink2Description: Datasheet; Mounting Technology: Surface Mount; ComponentLink2URL: http://www.onsemi.cn/pub_link/Collateral/ESD5Z2.5T1-D.PDF; PackageDescription: 2-Pin SOD, Body 1.2 x 0.8 mm; ComponentLink3URL: http://www.onsemi.com/pub_link/Collateral/502-01.PDF; ComponentLink1Description: Manufacturer URL
D22 = CMP-1055-00559-1: Dual Series Schottky Barrier Diodes, 3-Pin SOT-323, Pb-Free, Tape and Reel; Manufacturer: On Semiconductor; trr Max (ns): 5; IFSM Max (A): 0.6; ComponentLink1URL: http://www.onsemi.com/; Mounting Technology: Surface Mount; ComponentLink1Description: Manufacturer URL; ComponentLink3URL: http://www.onsemi.com/pub_link/Collateral/419-04.PDF; RoHS: TRUE; PackageVersion: Rev. N, 11/2008; Packing: Tape and Reel; PackageReference: SOT-323-3-419-04; ComponentLink2URL: http://www.onsemi.cn/pub_link/Collateral/BAT54SWT1-D.PDF; ComponentLink3Description: Package Specification; PackageDescription: 3-Pin Small Outline Transistor, Body 2 x 1.25 mm, Pitch 0.65 mm; ComponentLink2Description: Datasheet; PartNumber: BAT54SWT1G; DatasheetVersion: Rev. 10; Configuration: Dual
D30-D32 = CMP-1055-00560-1: Dual Series Schottky Barrier Diodes, 3-Pin SOT-323, Tape and Reel; Manufacturer: On Semiconductor; IFSM Max (A): 0.6; trr Max (ns): 5; ComponentLink3Description: Package Specification; RoHS: FALSE; ComponentLink1URL: http://www.onsemi.com/; PartNumber: BAT54SWT1; ComponentLink1Description: Manufacturer URL; Packing: Tape and Reel; PackageReference: SOT-323-3-419-04; ComponentLink2URL: http://www.onsemi.cn/pub_link/Collateral/BAT54SWT1-D.PDF; ComponentLink2Description: Datasheet; PackageDescription: 3-Pin Small Outline Transistor, Body 2 x 1.25 mm, Pitch 0.65 mm; Configuration: Dual; ComponentLink3URL: http://www.onsemi.com/pub_link/Collateral/419-04.PDF; Mounting Technology: Surface Mount; PackageVersion: Rev. N, 11/2008; DatasheetVersion: Rev. 10
FB8 FB10-FB12 FB14 FB19 = CMP-0220-00115-1: SMD EMI Suppression Ferrite Bead WE-CBF, Z = 1500 Ohm; DatasheetVersion: Dec-2005; ComponentLink1URL: http://www.we-online.com; PackageVersion: 2009; PackageDescription: Chip Inductor, 2-Leads, Body 1.6 x 0.8 mm; ComponentLink2URL: http://www.we-online.de/katalog/media/pdf/742792691.pdf; ComponentLink1Description: Manufacturer Link; ComponentLink2Description: Datasheet; Impedance: 1500 Ohm; PackageReference: SMD-0603
IC6 = MIC2290YML_TR: Integrated Circuit; Manufacturer_Name: Microchip; Manufacturer_Part_Number: MIC2290YML TR; Datasheet Link: http://ww1.microchip.com/downloads/en/DeviceDoc/mic2290.pdf; Height: 0.95mm; Arrow Part Number: MIC2290YML TR; Arrow Price/Stock: https://www.arrow.com/en/products/mic2290yml-tr/microchip-technology
J3 = Header 6: Header, 6-Pin; LatestRevisionDate: 17-Jul-2002; LatestRevisionNote: Re-released for DXP Platform.; Publisher: Altium Limited
L5 = CMP-0007-00012-1: Semi-shielded Power Inductor, 15 uH, +/- 20%, 0.8 A, -40 to 125 degC, 3 x 3 x 1.5 mm SMD, RoHS and Halogen Free, Tape and Reel; Manufacturer: Bourns; Isat: 0.68 A; Resistance to Solder Heat: +260 degC for 10 sec.; Inductance tolerance: +/- 20%; Rated current: 0.8 A; DCR Max: 0.422 Ohm; SRF Min: 33 MHz; Inductance: 15 uH; Core Material: Ferrite; Material: Steel; Max DC Current: 800mA; DC Resistance (DCR): 422mR; Self Resonant Frequency: 33MHz; Saturation Current: 680mA; Test Frequency: 1MHz; ComponentLink3Description: Package Specification; ComponentLink2URL: http://www.bourns.com/data/global/pdfs/SRN3015.pdf; Mounting Technology: Surface Mount; Operating Temperature: -40 to 125 degC; PartNumber: SRN3015-150M; ComponentLink1URL: http://www.bourns.com/; PackageReference: SRN3015; ComponentLink1Description: Manufacturer URL; PackageDescription: 2-Pin SMD, Body 3 x 3 mm, Height 1.5 mm; Packing: Tape and Reel; RoHS: TRUE; ComponentLink2Description: Datasheet; DatasheetVersion: Aug-11; ComponentLink3URL: http://www.bourns.com/data/global/pdfs/SRN3015.pdf; Supplier 1: Digi-Key; Supplier Part Number 1: SRN3015-150MCT-ND; Manufacturer Part Number: SRN3015-150M; Category: Fixed Inductors; Stock 1: 84; Pricing 1: 1=0.49000, 10=0.42400, 25=0.39400, 50=0.33360, 100=0.30320, 250=0.28500, 500=0.25468, 1000=0.20617 (USD); Case/Package: 1212; Number of Pins: 2; Weight: 0.001235oz; Min Operating Temperature: -40°C; Max Operating Temperature: 125°C; Package Quantity: 2000; Packaging: Tape and Reel; Termination: SMD/SMT; Tolerance: 20%; Shielding: Shielded; Current Rating: 800mA; Series: SRN3015; RMS Current (Irms): 800mA; Resistor Type: Wirewound; DC Current: 800mA; Frequency: 33MHz; Sample Rate (Hz): 1MHz; Length: 3mm; Width: 3mm; Height: 1.5mm; Height - Seated (Max): 0.059inch; Depth: 3.1mm; REACH SVHC: No SVHC; RoHS Compliant: Yes; Military Standard: Not; ComponentLink4URL: https://datasheet.ciiva.com/11802/0900766b80fe1f40-11802572.pdf?src-supplier=RSComponents; ComponentLink4Description: https://datasheet.ciiva.com/11802/0900766b80fe1f40-11802572.pdf?src-supplier=RSComponents; ComponentLink5URL: https://datasheet.ciiva.com/7849/1481208-7849509.pdf?src-supplier=Element14; ComponentLink5Description: https://datasheet.ciiva.com/7849/1481208-7849509.pdf?src-supplier=Element14; ComponentLink6URL: https://datasheet.ciiva.com/30224/587srn3015-30224969.pdf?src-supplier=Onlinecomponents.com; ComponentLink6Description: https://datasheet.ciiva.com/30224/587srn3015-30224969.pdf?src-supplier=Onlinecomponents.com; ComponentLink7URL: https://datasheet.ciiva.com/1048/srn3015-1048842.pdf?src-supplier=Digi-Key; ComponentLink7Description: https://datasheet.ciiva.com/1048/srn3015-1048842.pdf?src-supplier=Digi-Key; ComponentLink8URL: https://datasheet.ciiva.com/1048/srn3015-1048843.pdf?src-supplier=Digi-Key; ComponentLink8Description: https://datasheet.ciiva.com/1048/srn3015-1048843.pdf?src-supplier=Digi-Key; ComponentLink9URL: https://datasheet.ciiva.com/5986/1481208-5986171.pdf?src-supplier=Farnell; ComponentLink9Description: https://datasheet.ciiva.com/5986/1481208-5986171.pdf?src-supplier=Farnell; ComponentLink10URL: https://datasheet.ciiva.com/1048/srn3015-1048844.pdf?src-supplier=Digi-Key; ComponentLink10Description: https://datasheet.ciiva.com/1048/srn3015-1048844.pdf?src-supplier=Digi-Key; ComponentLink11URL: https://datasheet.ciiva.com/8515/srn3015-8515454.pdf?src-supplier=Avnet; ComponentLink11Description: https://datasheet.ciiva.com/8515/srn3015-8515454.pdf?src-supplier=Avnet; ComponentLink12URL: https://datasheet.ciiva.com/28678/1481208-28678223.pdf?src-supplier=Element14; ComponentLink12Description: https://datasheet.ciiva.com/28678/1481208-28678223.pdf?src-supplier=Element14
LED3 = CMP-1426-00005-1: SMD mono-color Chip LED, WL-SMCW, Yellow; Manufacturer: Wuerth Elektronik; Dominant Wavelength: 590nm; Viewing Angle: 140°; Lens Style: Clear,Rectangular; Luminous Intensity: 120mcd; Forward Voltage: 2V; Forward Current: 30mA; Test Current: 20mA; ComponentLink1URL: http://www.we-online.com; PartNumber: 150060YS75000; Color: Yellow; ComponentLink2Description: Datasheet; ComponentLink2URL: http://katalog.we-online.com/led/datasheet/150060YS75000.pdf; ComponentLink1Description: Manufacturer URL; PackageReference: 0603_A; Supplier 1: Digi-Key; Supplier Part Number 1: 732-4981-1-ND; Manufacturer Part Number: 150060YS75000; RoHS: Yes; Category: LEDs; Stock 1: 139; Pricing 1: 1=0.14000, 50=0.13300, 100=0.11400, 500=0.09900 (USD); Mount: Surface Mount; Case/Package: 0603; Case Code (Imperial): 0603; Case Code (Metric): 1608; Min Operating Temperature: -40°C; Max Operating Temperature: 85°C; Packaging: Tape and Reel; Package Quantity: 4000; Wavelength: 590nm; Length: 1.6mm; Height: 0.7mm; Width: 0.8mm; REACH SVHC: Unknown; ComponentLink3URL: https://datasheet.ciiva.com/23843/150060ys75000-23843250.pdf?src-supplier=Newark; ComponentLink3Description: https://datasheet.ciiva.com/23843/150060ys75000-23843250.pdf?src-supplier=Newark; ComponentLink4URL: https://datasheet.ciiva.com/29279/759432-da-01-en-chipled-0603-w-kl-gelb-150060ys75000-29279206.pdf?src-supplier=Conrad; ComponentLink4Description: https://datasheet.ciiva.com/29279/759432-da-01-en-chipled-0603-w-kl-gelb-150060ys75000-29279206.pdf?src-supplier=Conrad; ComponentLink5URL: https://datasheet.ciiva.com/29563/150060ys75000-29563045.pdf?src-supplier=Digi-Key; ComponentLink5Description: https://datasheet.ciiva.com/29563/150060ys75000-29563045.pdf?src-supplier=Digi-Key; ComponentLink6URL: https://datasheet.ciiva.com/22656/1911348-22656951.pdf?src-supplier=Element14; ComponentLink6Description: https://datasheet.ciiva.com/22656/1911348-22656951.pdf?src-supplier=Element14; ComponentLink7URL: https://datasheet.ciiva.com/29563/150060ys75000-29563033.pdf?src-supplier=Digi-Key; ComponentLink7Description: https://datasheet.ciiva.com/29563/150060ys75000-29563033.pdf?src-supplier=Digi-Key; ComponentLink8URL: https://datasheet.ciiva.com/48430/150060ys75000-eng-tds-48430044.pdf?src-supplier=Distrelec; ComponentLink8Description: https://datasheet.ciiva.com/48430/150060ys75000-eng-tds-48430044.pdf?src-supplier=Distrelec
NTC4 = CMP-06022-001050-1: Thermistor NTC 10kΩ ±1% 2-Pin Radial Bulk; Resistance: 10kR; Max Power Dissipation: 7.5mW; Lead Diameter: 0.4mm; RoHS Compliant: Yes; Number of Pins: 2; Lead Free: Lead Free; Height: 2mm; Lead Pitch: 2.5mm; Power Rating: 7.5mW; Series: NXR; Packaging: Bulk; Package Quantity: 500; Width: 4mm; Max Operating Temperature: 125°C; Termination: Radial; Min Operating Temperature: -40°C; Tolerance: 1%; Resistance Tolerance: 1%; Length: 5mm; Mount: Through Hole
P4 = CMP-1024-00383-1: 0.025" SQ Post Header, Through-hole, Vertical, -55 to 125 degC, 2.54 mm Pitch, 6-Pin, Male, RoHS; Manufacturer: Samtec; Pitch: 2.54 mm; RoHS: True; ComponentLink1Description: Manufacturer URL; DatasheetVersion: F-214; Orientation: Vertical; ComponentLink1URL: http://www.samtec.com; ComponentLink3Description: Package Specification; ComponentLink2Description: Datasheet; PackageVersion: DM, 8/1988; PackageDescription: .025[0.64] SQ. Post Terminal Strip Assembly; PackageReference: TSW-106-07-X-S; Mounting Technology: Through-hole; Temperature Range: -55 to 125 degC; ComponentLink3URL: http://www.samtec.com/documents/webfiles/cpdf/TSW-XXX-XX-XXX-X-XX-XXX-MKT.pdf; ComponentLink2URL: http://www.samtec.com/documents/webfiles/pdf/TSW_TH.PDF; PartNumber: TSW-106-07-G-S
Q13 = CMP-2000-06730-1: NPN General-Purpose Amplifier, 0.6 A, 40 V, -55 to 150 degC, 3-Pin SOT-23, RoHS, Tape and Reel; Collector- Base Voltage VCBO: 60V; Collector- Emitter Voltage VCEO Max: 40V; DC Collector/Base Gain hfe Min: 100; Collector-Emitter Saturation Voltage: 0.75V; Maximum Power Dissipation: 350mW; Unit Weight: 0.002116oz; Configuration: Single; Emitter- Base Voltage VEBO: 6V; Brand: FairchildSemiconductor; Maximum DC Collector Current: 0.6A; Package Version: Rev. 12, 03/2016; DC Current Gain hFE Max: 300; Gain Bandwidth Product fT: 250MHz; Factory Pack Quantity: 3000; Product Category: BipolarTransistors-BJT; Packaging: Reel; Datasheet URL: https://www.fairchildsemi.com/datasheets/2N/2N4401.pdf; Transistor Polarity: NPN; Mounting Style: SMD/SMT; Manufacturer URL: https://www.fairchildsemi.com/; Package Description: 3-Pin Small Outline Transistor, Body 2.92 x 1.325 mm, Pitch 0.95 mm; Maximum Operating Temperature: +150C; Minimum Operating Temperature: -55C; Package Reference: SOT23-3; RoHS: Details; Datasheet Version: Rev. 1.1.0, 11/2014; Series: MMBT4401; Package URL: http://www.fairchildsemi.com/dwg/MA/MA03D.pdf; Package / Case: SOT-23; Mounting Technology: SurfaceMount; Manufacturer: FairchildSemiconductor
Q14 = CMP-1048-00392-1: Complementary General Purpose Transistors, 6-Pin SC70, Pb-Free, Tape and Reel; Manufacturer: On Semiconductor; IC Continuous (A): 0.2; Packing: Tape and Reel; ComponentLink2URL: http://www.onsemi.com/pub_link/Collateral/MBT3946DW1T1-D.PDF; Mounting Technology: Surface Mount; PackageDescription: 6-Pin Small Outline Transistor, Body 2 x 1.25 mm, Pitch 0.65 mm; ComponentLink1URL: http://www.onsemi.com/; Polarity: Complementary; RoHS: TRUE; ComponentLink1Description: Manufacturer URL; ComponentLink3Description: Package Specification; DatasheetVersion: Rev. 7; PackageReference: SC70-6-419B-02_W; ComponentLink2Description: Datasheet; PackageVersion: Rev. W; PartNumber: MBT3946DW1T2G; ComponentLink3URL: http://www.onsemi.com/pub_link/Collateral/SMF05C-D.PDF
Q15 Q20 = CMP-2000-05568-2: MOSFET N-CH 60V 115MA SOT323; Element Configuration: Single; Nominal Vgs: 2V; Drain to Source Breakdown Voltage: 70V; Drain to Source Resistance: 2.6R; Input Capacitance: 50pF; On-State Resistance: 7.5R; Number of Channels: 1; Power Dissipation: 200mW; Turn-Off Delay Time: 11ns; Turn-On Delay Time: 7ns; Gate to Source Voltage (Vgs): 20V; Dual Supply Voltage: 60V; Contact Plating: Tin; Min Operating Temperature: -55°C; Radiation Hardening: No; Drain to Source Voltage (Vdss): 60V; Height: 1mm; Max Operating Temperature: 150°C; Voltage Rating (DC): 60V; Case/Package: SOT-323; Weight: 0.000212oz; Mount: Surface Mount; Length: 2.2mm; Lead Free: Lead Free; Threshold Voltage: 2V; Packaging: Tape and Reel; Max Power Dissipation: 200mW; Package Quantity: 1; Continuous Drain Current (ID): 115mA; Number of Pins: 3; Width: 1.35mm; Current Rating: 115mA; Rds On Max: 7.5R; REACH SVHC: No SVHC; Termination: SMD/SMT; Number of Elements: 1
Q19 = CMP-2000-04929-1: N-Channel Enhancement Mode Field Effect Transistor, 60 V, 0.115 A, -55 to 150 degC, 3-Pin SOT23, RoHS, Tape and Reel; Id - Continuous Drain Current: 115mA; Typical Turn-On Delay Time: 7ns; Typical Turn-Off Delay Time: 11ns; Brand: DiodesIncorporated; Transistor Type: 1N-Channel; Vgs - Gate-Source Voltage: 20V; Rise Time: 3ns; Configuration: Single; Fall Time: 5.6ns; Vds - Drain-Source Breakdown Voltage: 70V; Rds On - Drain-Source Resistance: 7.5Ohms; Number of Channels: 1Channel; Forward Transconductance - Min: 0.08S; Pd - Power Dissipation: 300mW; Unit Weight: 0.000282oz; Datasheet URL: http://datasheet.octopart.com/2N7002-7-F-Diodes-Inc.-datasheet-8326113.pdf; Width: 1.3mm; Series: 2N7002; Length: 2.9mm; Product Category: MOSFET; Minimum Operating Temperature: -55C; Manufacturer URL: http://www.diodes.com/; Mounting Style: SMD/SMT; Package Reference: SOT23-3; Package Description: 3-Pin Small Outline Transistor, Body 2.9 x 1.3 mm, Pitch 0.96 mm; Maximum Operating Temperature: +150C; Transistor Polarity: N-Channel; Factory Pack Quantity: 3000; Technology: Si; Channel Mode: Enhancement; Datasheet Version: Rev. 21-2, 02/2009; Type: EnhancementModeFieldEffectTransistor; RoHS: True; Packaging: Reel; Package / Case: SOT-23-3; Height: 1mm; Product: MOSFETSmallSignal; Manufacturer: DiodesIncorporated
Q21 = BJT-NPN-BEC-3: NPN General-Purpose Amplifier, 0.6 A, 40 V, -55 to 150 degC, 3-Pin SOT-23, RoHS, Tape and Reel; Collector- Base Voltage VCBO: 60V; Collector- Emitter Voltage VCEO Max: 40V; DC Collector/Base Gain hfe Min: 100; Collector-Emitter Saturation Voltage: 0.75V; Maximum Power Dissipation: 350mW; Unit Weight: 0.002116oz; Configuration: Single; Emitter- Base Voltage VEBO: 6V; Brand: FairchildSemiconductor; Maximum DC Collector Current: 0.6A; Package Version: Rev. 12, 03/2016; DC Current Gain hFE Max: 300; Gain Bandwidth Product fT: 250MHz; Factory Pack Quantity: 3000; Product Category: BipolarTransistors-BJT; Packaging: Reel; Datasheet URL: https://www.fairchildsemi.com/datasheets/2N/2N4401.pdf; Transistor Polarity: NPN; Mounting Style: SMD/SMT; Manufacturer URL: https://www.fairchildsemi.com/; Package Description: 3-Pin Small Outline Transistor, Body 2.92 x 1.325 mm, Pitch 0.95 mm; Maximum Operating Temperature: +150C; Minimum Operating Temperature: -55C; Package Reference: SOT23-3; RoHS: Details; Datasheet Version: Rev. 1.1.0, 11/2014; Series: MMBT4401; Package URL: http://www.fairchildsemi.com/dwg/MA/MA03D.pdf; Package / Case: SOT-23; Mounting Technology: SurfaceMount; Manufacturer: FairchildSemiconductor
R16 R18 R142 = RES_EMPTY_0805: Resistor, 0805 SMD, Empty footprint; Value: N/A; Package / Case: 0805 (2012 metric)
R40 R89 R102 R194 = CMP-2003-02667-1: Manufacturer: Susumu; Part Number: RG3216P-1002-B-T5
R45-R47 R52 R56 R80 R90-R92 R94 R96 R97 = CMP-1014-00867-1: 1M5 0.25W 1% 1206 (3216 Metric)  SMD; Manufacturer: Yageo; Manufacturer Part Number: RT1206BRD07422KL; Case-EIA: 1206; Value: 1500000.00 Ohm; Case-Metric: 3216; Resistance: 422kR; Temperature Coefficient: 25ppm/°C; Power Rating: 250mW; Voltage Rating: 200V; Tolerance: 1 %; Power: 0.25 W; Technology: SMT; Supplier 1: Avnet; Supplier Part Number 1: RT1206BRD07422KL; RoHS: Yes; Category: Chip SMD Resistors; Pricing 1: 5000=0.04959, 10000=0.04889, 20000=0.04749, 30000=0.04644, 40000=0.04470, 50000=0.04365, 500000=0.04260 (USD); Case/Package: 1206; Case Code (Metric): 3216; Case Code (Imperial): 1206; Min Operating Temperature: -55°C; Max Operating Temperature: 125°C; Packaging: Tape and Reel; Series: RT; Number of Terminations: 2; Package Quantity: 5000; Max Power Dissipation: 250mW; Resistor Type: Thin Film; Termination: SMD/SMT; Voltage Rating (DC): 200V; Length: 0.122inch; Width: 0.063inch; Height: 0.026inch; RoHS Compliant: Yes; Lead Free: Lead Free; ComponentLink1URL: https://datasheet.ciiva.com/2587/pyu-rt-1-to-0-05-rohs-l-5-2587699.pdf?src-supplier=Digi-Key; ComponentLink1Description: https://datasheet.ciiva.com/2587/pyu-rt-1-to-0-05-rohs-l-5-2587699.pdf?src-supplier=Digi-Key; ComponentLink2URL: https://datasheet.ciiva.com/12702/pyu-rt-1-to-0-05-rohs-l-4-12702650.pdf?src-supplier=Mouser; ComponentLink2Description: https://datasheet.ciiva.com/12702/pyu-rt-1-to-0-05-rohs-l-4-12702650.pdf?src-supplier=Mouser